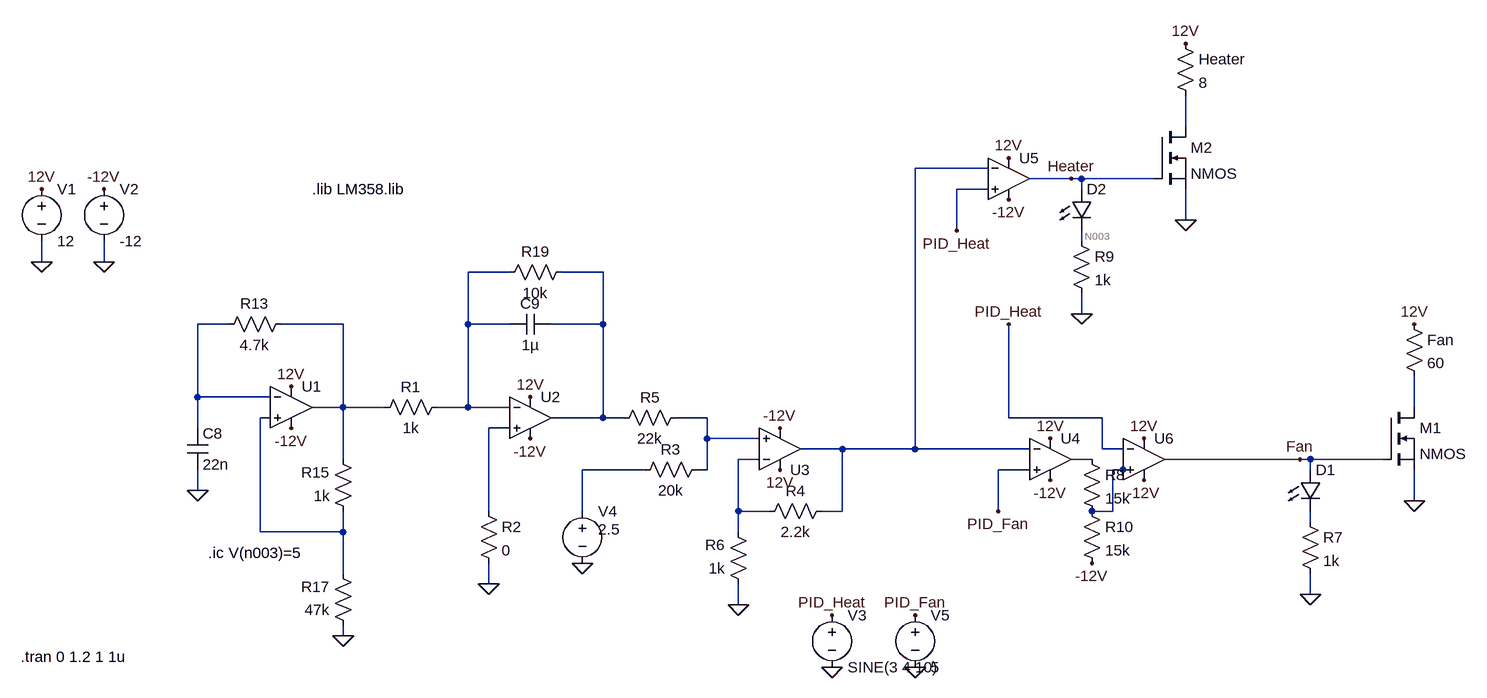
[diagram p0: schematic driver_unit.asc]
driver_unit.asc, the LTspice schematic file:
Version 4
SHEET 1 3412 1124
WIRE 2976 -1680 2976 -1728
WIRE 2672 -1616 2560 -1616
WIRE 2800 -1600 2736 -1600
WIRE 2816 -1600 2800 -1600
WIRE 2928 -1600 2816 -1600
WIRE 2672 -1584 2624 -1584
WIRE 2816 -1584 2816 -1600
WIRE 2976 -1536 2976 -1584
WIRE 2624 -1520 2624 -1584
WIRE 2816 -1504 2816 -1520
WIRE 1216 -1472 1216 -1504
WIRE 1312 -1472 1312 -1504
WIRE 1936 -1456 1872 -1456
WIRE 2080 -1456 2016 -1456
WIRE 2816 -1392 2816 -1424
WIRE 1504 -1376 1456 -1376
WIRE 1680 -1376 1584 -1376
WIRE 1872 -1376 1872 -1456
WIRE 1936 -1376 1872 -1376
WIRE 2080 -1376 2080 -1456
WIRE 2080 -1376 2000 -1376
WIRE 1456 -1264 1456 -1376
WIRE 1568 -1264 1456 -1264
WIRE 1680 -1248 1680 -1376
WIRE 1680 -1248 1632 -1248
WIRE 1744 -1248 1680 -1248
WIRE 1872 -1248 1872 -1376
WIRE 1872 -1248 1824 -1248
WIRE 1936 -1248 1872 -1248
WIRE 3328 -1248 3328 -1296
WIRE 1568 -1232 1552 -1232
WIRE 2080 -1232 2080 -1376
WIRE 2080 -1232 2000 -1232
WIRE 2112 -1232 2080 -1232
WIRE 2240 -1232 2192 -1232
WIRE 2704 -1232 2704 -1376
WIRE 2848 -1232 2704 -1232
WIRE 1456 -1216 1456 -1264
WIRE 1936 -1216 1904 -1216
WIRE 2240 -1200 2240 -1232
WIRE 2320 -1200 2240 -1200
WIRE 2448 -1184 2384 -1184
WIRE 2560 -1184 2560 -1616
WIRE 2560 -1184 2448 -1184
WIRE 2736 -1184 2560 -1184
WIRE 2848 -1184 2848 -1232
WIRE 2880 -1184 2848 -1184
WIRE 1680 -1168 1680 -1248
WIRE 2320 -1168 2288 -1168
WIRE 2832 -1168 2800 -1168
WIRE 3152 -1168 2944 -1168
WIRE 3168 -1168 3152 -1168
WIRE 3280 -1168 3168 -1168
WIRE 2144 -1152 2048 -1152
WIRE 2240 -1152 2240 -1200
WIRE 2240 -1152 2224 -1152
WIRE 2736 -1152 2688 -1152
WIRE 2880 -1152 2864 -1152
WIRE 2896 -1152 2880 -1152
WIRE 3168 -1152 3168 -1168
WIRE 1456 -1120 1456 -1152
WIRE 3328 -1104 3328 -1152
WIRE 1904 -1088 1904 -1216
WIRE 2048 -1088 2048 -1152
WIRE 2288 -1088 2288 -1168
WIRE 2336 -1088 2288 -1088
WIRE 2448 -1088 2448 -1184
WIRE 2448 -1088 2416 -1088
WIRE 2688 -1088 2688 -1152
WIRE 2864 -1088 2864 -1152
WIRE 2864 -1088 2832 -1088
WIRE 3168 -1072 3168 -1088
WIRE 1552 -1056 1552 -1232
WIRE 1680 -1056 1680 -1088
WIRE 1680 -1056 1552 -1056
WIRE 2288 -1056 2288 -1088
WIRE 1680 -992 1680 -1056
WIRE 1904 -976 1904 -1008
WIRE 3168 -960 3168 -992
WIRE 2288 -944 2288 -976
WIRE 1680 -896 1680 -912
FLAG 1216 -1472 0
FLAG 1216 -1584 12V
FLAG 1312 -1472 0
FLAG 1312 -1584 -12V
FLAG 1600 -1216 -12V
FLAG 1600 -1280 12V
FLAG 1456 -1120 0
FLAG 1680 -896 0
FLAG 1904 -976 0
FLAG 1968 -1200 -12V
FLAG 1968 -1264 12V
FLAG 2352 -1216 -12V
FLAG 2352 -1152 12V
FLAG 2288 -944 0
FLAG 2432 -928 PID_Heat
FLAG 2432 -848 0
FLAG 2768 -1136 -12V
FLAG 2768 -1200 12V
FLAG 2688 -1088 PID_Fan
FLAG 3152 -1168 Fan
FLAG 3328 -1104 0
FLAG 3168 -960 0
FLAG 2704 -1568 -12V
FLAG 2704 -1632 12V
FLAG 2624 -1520 PID_Heat
FLAG 2800 -1600 Heater
FLAG 2976 -1536 0
FLAG 2816 -1392 0
FLAG 3328 -1376 12V
FLAG 2976 -1808 12V
FLAG 2560 -928 PID_Fan
FLAG 2560 -848 0
FLAG 2912 -1136 -12V
FLAG 2912 -1200 12V
FLAG 2704 -1376 PID_Heat
FLAG 2832 -1008 -12V
FLAG 2048 -1008 0
SYMBOL voltage 1216 -1600 R0
SYMATTR InstName V1
SYMATTR Value 12
SYMBOL voltage 1312 -1600 R0
WINDOW 123 0 0 Left 0
WINDOW 39 0 0 Left 0
SYMATTR InstName V2
SYMATTR Value -12
SYMBOL cap 1440 -1216 R0
SYMATTR InstName C8
SYMATTR Value 22n
SYMBOL cap 2000 -1392 R90
WINDOW 0 0 32 VBottom 2
WINDOW 3 32 32 VTop 2
SYMATTR InstName C9
SYMATTR Value 1µ
SYMBOL res 1600 -1392 R90
WINDOW 0 0 56 VBottom 2
WINDOW 3 32 56 VTop 2
SYMATTR InstName R13
SYMATTR Value 4.7k
SYMBOL res 1696 -1072 R180
WINDOW 0 36 76 Left 2
WINDOW 3 36 40 Left 2
SYMATTR InstName R15
SYMATTR Value 1k
SYMBOL res 1696 -896 R180
WINDOW 0 36 76 Left 2
WINDOW 3 36 40 Left 2
SYMATTR InstName R17
SYMATTR Value 47k
SYMBOL res 2032 -1472 R90
WINDOW 0 0 56 VBottom 2
WINDOW 3 32 56 VTop 2
SYMATTR InstName R19
SYMATTR Value 10k
SYMBOL Opamps\\UniversalOpamp2 1600 -1248 R0
SYMATTR InstName U1
SYMBOL res 1840 -1264 R90
WINDOW 0 0 56 VBottom 2
WINDOW 3 32 56 VTop 2
SYMATTR InstName R1
SYMATTR Value 1k
SYMBOL res 1888 -1104 R0
SYMATTR InstName R2
SYMATTR Value 0
SYMBOL res 2240 -1168 R90
WINDOW 0 0 56 VBottom 2
WINDOW 3 32 56 VTop 2
SYMATTR InstName R3
SYMATTR Value 20k
SYMBOL res 2096 -1216 R270
WINDOW 0 32 56 VTop 2
WINDOW 3 0 56 VBottom 2
SYMATTR InstName R5
SYMATTR Value 22k
SYMBOL voltage 2432 -944 R0
WINDOW 123 0 0 Left 0
WINDOW 39 0 0 Left 0
SYMATTR InstName V3
SYMATTR Value SINE(3 4 10)
SYMBOL Opamps\\UniversalOpamp2 1968 -1232 R0
SYMATTR InstName U2
SYMBOL Opamps\\UniversalOpamp2 2352 -1184 M180
SYMATTR InstName U3
SYMBOL res 2432 -1104 R90
WINDOW 0 0 56 VBottom 2
WINDOW 3 32 56 VTop 2
SYMATTR InstName R4
SYMATTR Value 2.2k
SYMBOL res 2304 -960 R180
WINDOW 0 36 76 Left 2
WINDOW 3 36 40 Left 2
SYMATTR InstName R6
SYMATTR Value 1k
SYMBOL Opamps\\UniversalOpamp2 2768 -1168 R0
SYMATTR InstName U4
SYMBOL nmos 3280 -1248 R0
SYMATTR InstName M1
SYMBOL LED 3152 -1152 R0
WINDOW 3 24 64 Invisible 2
SYMATTR Value NSSW008CT-P1
SYMATTR InstName D1
SYMATTR Description Diode
SYMATTR Type diode
SYMBOL res 3152 -1088 R0
SYMATTR InstName R7
SYMATTR Value 1k
SYMBOL res 3312 -1392 R0
SYMATTR InstName Fan
SYMATTR Value 60
SYMBOL Opamps\\UniversalOpamp2 2704 -1600 R0
SYMATTR InstName U5
SYMBOL nmos 2928 -1680 R0
SYMATTR InstName M2
SYMBOL res 2800 -1520 R0
SYMATTR InstName R9
SYMATTR Value 1k
SYMBOL res 2960 -1824 R0
SYMATTR InstName Heater
SYMATTR Value 8
SYMBOL LED 2800 -1584 R0
WINDOW 3 24 64 Invisible 2
SYMATTR Value NSSW008CT-P1
SYMATTR InstName D2
SYMATTR Description Diode
SYMATTR Type diode
SYMBOL voltage 2560 -944 R0
WINDOW 123 0 0 Left 0
WINDOW 39 0 0 Left 0
SYMATTR InstName V5
SYMATTR Value 5
SYMBOL Opamps\\UniversalOpamp2 2912 -1168 R0
SYMATTR InstName U6
SYMBOL res 2816 -1184 R0
SYMATTR InstName R8
SYMATTR Value 15k
SYMBOL res 2816 -1104 R0
SYMATTR InstName R10
SYMATTR Value 15k
SYMBOL voltage 2048 -1104 R0
WINDOW 123 0 0 Left 0
WINDOW 39 0 0 Left 0
WINDOW 3 24 44 Left 2
SYMATTR InstName V4
SYMATTR Value 2.5
TEXT 1632 -1584 Left 2 !.lib LM358.lib
TEXT 1184 -864 Left 2 !.tran 0 1.2 1 1u
TEXT 1472 -1024 Left 2 !.ic V(n003)=5

The netlist it stands for:
* driver_unit.asc
V1 12V 0 12
V2 -12V 0 -12
C8 N006 0 22n
C9 N005 N004 1µ
R13 N007 N006 4.7k
R15 N009 N007 1k
R17 0 N009 47k
R19 N005 N004 10k
XU1 N009 N006 12V -12V N007 level.2 Avol=1Meg GBW=10Meg Slew=10Meg ilimit=25m rail=0 Vos=0 phimargin=45 en=0 enk=0 in=0 ink=0 Rin=500Meg  ; pins IN+ IN- V+ V- OUT
R1 N004 N007 1k
R2 N011 0 0
R3 N010 N014 20k
R5 N005 N010 22k
V3 PID_Heat 0 SINE(3 4 10)
XU2 N011 N004 12V -12V N005 level.2 Avol=1Meg GBW=10Meg Slew=10Meg ilimit=25m rail=0 Vos=0 phimargin=45 en=0 enk=0 in=0 ink=0 Rin=500Meg  ; pins IN+ IN- V+ V- OUT
XU3 N010 N012 12V -12V N002 level.2 Avol=1Meg GBW=10Meg Slew=10Meg ilimit=25m rail=0 Vos=0 phimargin=45 en=0 enk=0 in=0 ink=0 Rin=500Meg  ; pins IN+ IN- V+ V- OUT
R4 N002 N012 2.2k
R6 0 N012 1k
XU4 PID_Fan N002 12V -12V N013 level.2 Avol=1Meg GBW=10Meg Slew=10Meg ilimit=25m rail=0 Vos=0 phimargin=45 en=0 enk=0 in=0 ink=0 Rin=500Meg  ; pins IN+ IN- V+ V- OUT
M1 N008 Fan 0 0 NMOS
D1 Fan N016 NSSW008CT-P1
R7 N016 0 1k
R§Fan 12V N008 60
XU5 PID_Heat N002 12V -12V Heater level.2 Avol=1Meg GBW=10Meg Slew=10Meg ilimit=25m rail=0 Vos=0 phimargin=45 en=0 enk=0 in=0 ink=0 Rin=500Meg  ; pins IN+ IN- V+ V- OUT
M2 N001 Heater 0 0 NMOS
R9 N003 0 1k
R§Heater 12V N001 8
D2 Heater N003 NSSW008CT-P1
V5 PID_Fan 0 5
XU6 N015 PID_Heat 12V -12V Fan level.2 Avol=1Meg GBW=10Meg Slew=10Meg ilimit=25m rail=0 Vos=0 phimargin=45 en=0 enk=0 in=0 ink=0 Rin=500Meg  ; pins IN+ IN- V+ V- OUT
R8 N013 N015 15k
R10 N015 -12V 15k
V4 N014 0 2.5
.model D D
.lib standard.dio
.model NMOS NMOS
.model PMOS PMOS
.lib standard.mos
.lib LM358.lib
.tran 0 1.2 1 1u
.ic V(n003)=5
.lib UniversalOpamps2.sub
.backanno
.end